# Altium schematic sheet HA-NM5500A_20130.SchDoc
size A4
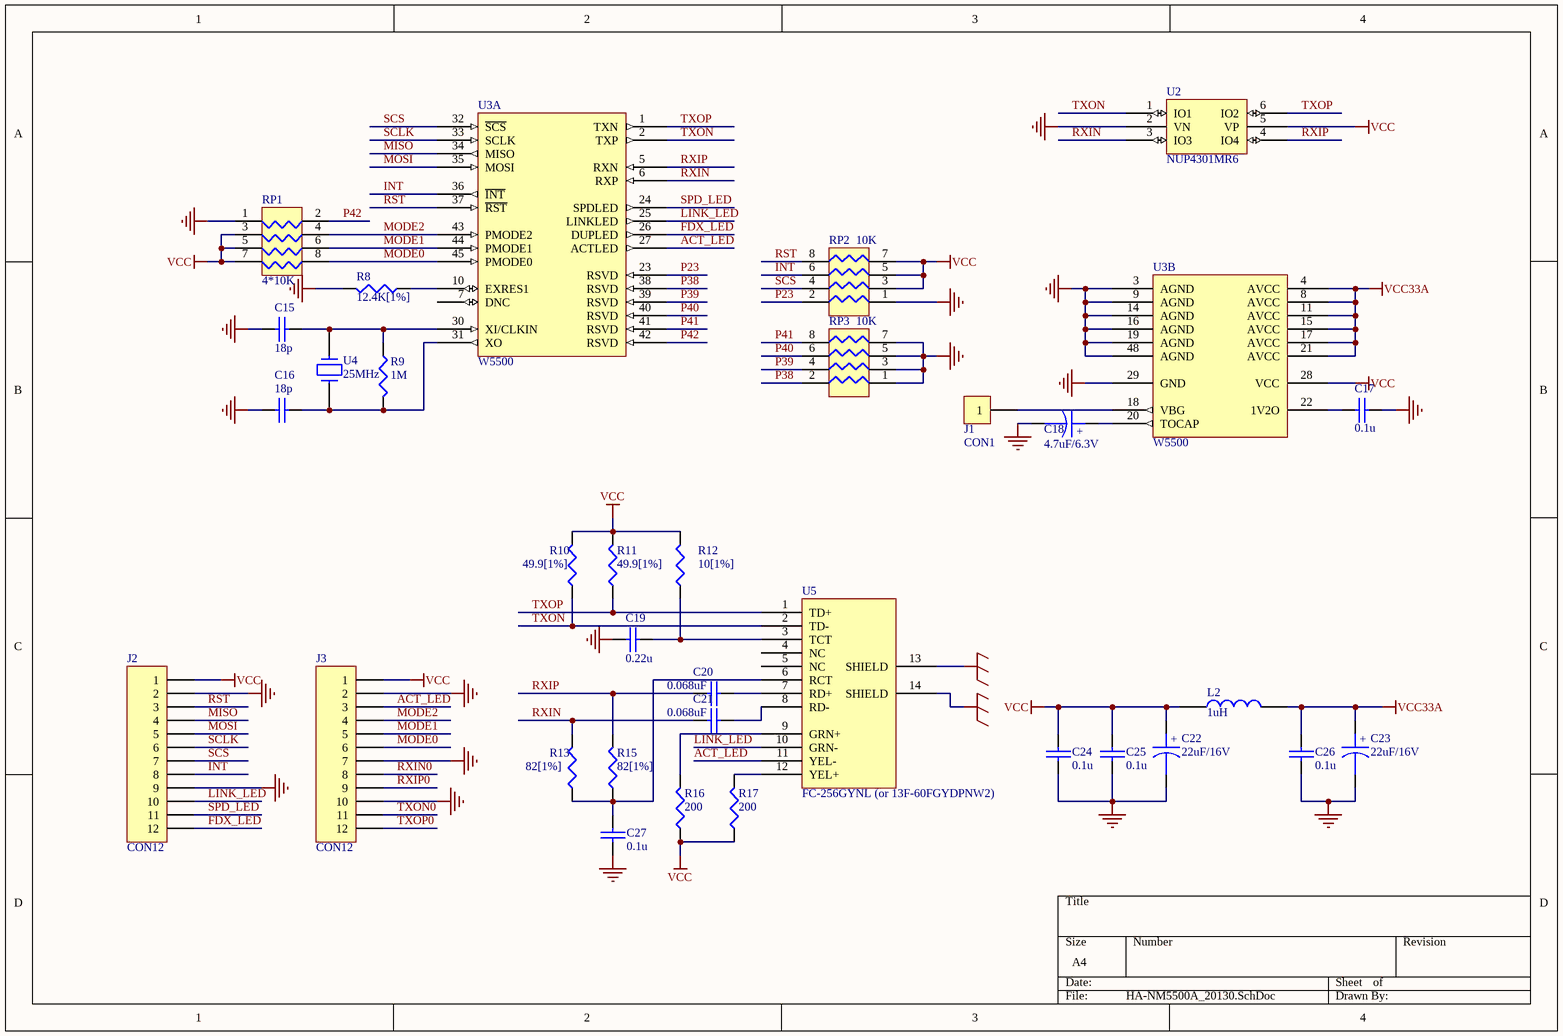
[diagram p0: HA-NM5500A_20130.SchDoc]

## Parts
C15  18p  [0603]
C16  18p  [0603]
C17  0.1u  [0603]
C18  4.7uF/6.3V  [CAP-B]
C19  0.22u  [0603]
C20  0.068uF  [0603]
C21  0.068uF  [0603]
C22  22uF/16V  [CAP-B]
C23  22uF/16V  [CAP-B]
C24  0.1u  [0603]
C25  0.1u  [0603]
C26  0.1u  [0603]
C27  0.1u  [0603]
J1  CON1
J2  CON12
J3  CON12
L2  1uH  [0603]
R8  12.4K[1%]  [0603]
R9  1M  [0603]
R10  49.9[1%]  [0603]
R11  49.9[1%]  [0603]
R12  10[1%]  [0603]
R13  82[1%]  [0603]
R15  82[1%]  [0603]
R16  200  [0603]
R17  200  [0603]
RP1  4*10K  [4X0603]
RP2  10K  [SIP9]
RP3  10K  [SIP9]
U2  NUP4301MR6  [TSOP-6]
U3  W5500  [LQFP-48]  (parts A,B of 2)
U4  25MHz  [XTAL]
U5  FC-256GYNL (or 13F-60FGYDPNW2)  [RJ45-2]

## Nets
EGND: U5.13(SHIELD)
EGND1: U5.14(SHIELD)
GND: C15.2 C16.2 C17.1 C18.2 C19.1 C22.2 C23.2 C24.2 C25.2 C26.2 C27.2 J2.2 J2.9 J3.2 J3.7 J3.10 R8.2 RP1.1 RP2.1 RP3.1 RP3.3 RP3.5 RP3.7 U2.2(VN) U3.3(AGND) U3.9(AGND) U3.14(AGND) U3.16(AGND) U3.19(AGND) U3.29(GND) U3.48(AGND)
VCC: C22.1 C24.1 C25.1 J2.1 J3.1 L2.1 R10.2 R11.2 R12.2 R16.1 R17.1 RP1.3 RP1.5 RP1.7 RP2.3 RP2.5 RP2.7 U2.5(VP) U3.28(VCC)
VCC33A: C23.1 C26.1 L2.2 U3.4(AVCC) U3.8(AVCC) U3.11(AVCC) U3.15(AVCC) U3.17(AVCC) U3.21(AVCC)
ACT_LED: J3.3 U3.27(ACTLED) U5.11(YEL-)
FDX_LED: J2.12 U3.26(DUPLED)
INT: J2.8 RP2.6 U3.36(~{INT})
LINK_LED: J2.10 U3.25(LINKLED) U5.10(GRN-)
MISO: J2.4 U3.34(MISO)
MODE0: J3.6 RP1.8 U3.45(PMODE0)
MODE1: J3.5 RP1.6 U3.44(PMODE1)
MODE2: J3.4 RP1.4 U3.43(PMODE2)
MOSI: J2.5 U3.35(MOSI)
P23: RP2.2 U3.23(RSVD)
P38: RP3.2 U3.38(RSVD)
P39: RP3.4 U3.39(RSVD)
P40: RP3.6 U3.40(RSVD)
P41: RP3.8 U3.41(RSVD)
P42: RP1.2 U3.42(RSVD)
RST: J2.3 RP2.8 U3.37(~{RST})
RXIN: C21.1 R13.2 U2.3(IO3) U3.6(RXP)
RXIN0: J3.8
RXIP: C20.1 R15.2 U2.4(IO4) U3.5(RXN)
RXIP0: J3.9
SCLK: J2.6 U3.33(SCLK)
SCS: J2.7 RP2.4 U3.32(~{SCS})
SPD_LED: J2.11 U3.24(SPDLED)
TXON: R10.1 U2.1(IO1) U3.2(TXP) U5.2(TD-)
TXON0: J3.11
TXOP: R11.1 U2.6(IO2) U3.1(TXN) U5.1(TD+)
TXOP0: J3.12
NetC15_1: C15.1 R9.1 U3.30(XI/CLKIN) U4.1
NetC16_1: C16.1 R9.2 U3.31(XO) U4.2
NetC17_2: C17.2 U3.22(1V2O)
NetC18_1: C18.1 U3.20(TOCAP)
NetC19_2: C19.2 R12.1 U5.3(TCT)
NetC20_2: C20.2 U5.7(RD+)
NetC21_2: C21.2 U5.8(RD-)
NetC27_1: C27.1 R13.1 R15.1 U5.6(RCT)
NetJ1_1: J1.1 U3.18(VBG)
NetR8_1: R8.1 U3.10(EXRES1)
NetR16_2: R16.2 U5.9(GRN+)
NetR17_2: R17.2 U5.12(YEL+)

Not connected (* = marked no-connect by the designer): U3 7(DNC); U5 4(NC) 5(NC)

## Notes on the sheet
- (in symbol CAPACITOR POL) +

## Library data of the parts
C15-C17 C19-C21 C24-C27 = CAP: Capacitor
C18 C22 C23 = CAPACITOR POL: Capacitor
J1 = CON1: Connector
J2 J3 = CON12: Connector
L2 = INDUCTOR
R8-R13 R15-R17 = RES1
RP1-RP3 = RP4: RP8
U2 = NUP4301: NUP4301MR6T1
U4 = CRYSTAL
U5 = LU1T516